# EAGLE schematic BMBurner V1.1 (EAGLE 8.6.0)
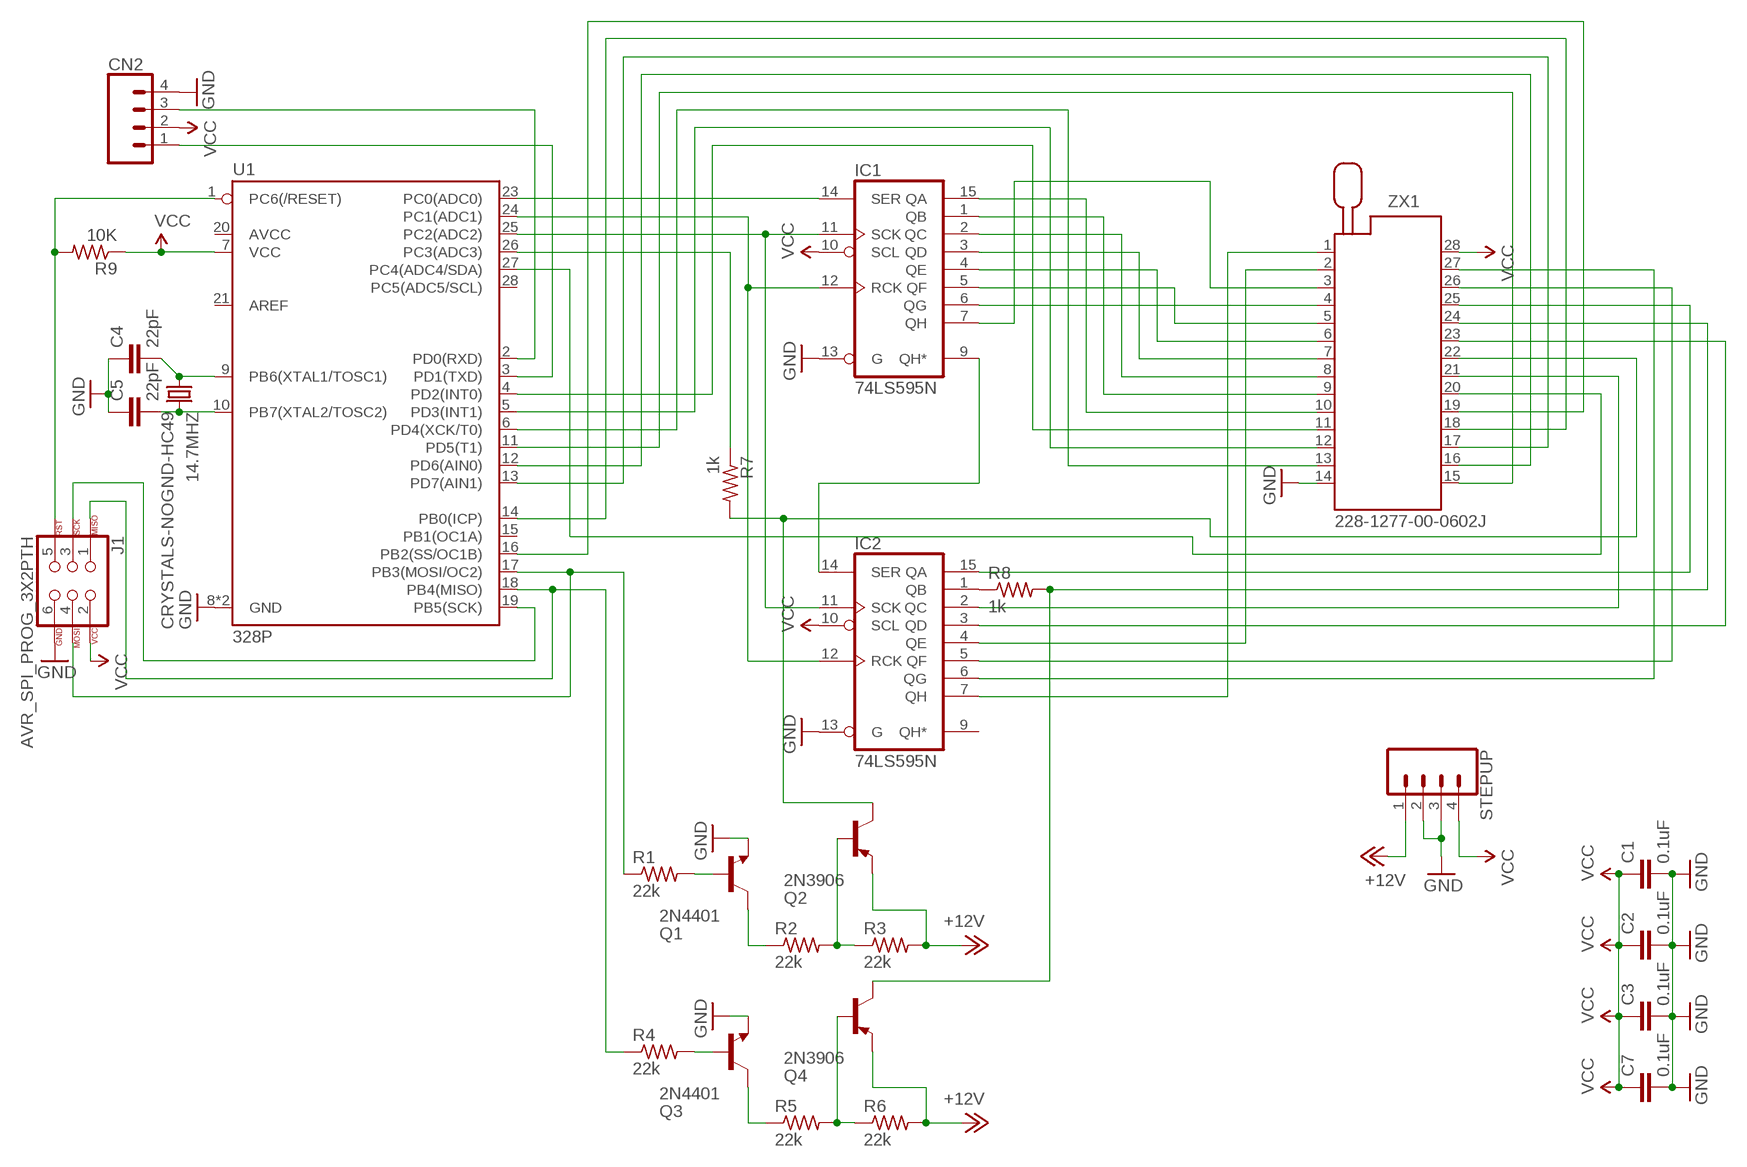
[diagram p0: schematic, sheet 1]

## Parts
14.7MHZ  CRYSTALS-NOGND-HC49  [HC49]
C1  0.1uF  CAPPTH  [CAP-PTH-SMALL]
C2  0.1uF  CAPPTH  [CAP-PTH-SMALL]
C3  0.1uF  CAPPTH  [CAP-PTH-SMALL]
C4  22pF  CAPPTH  [CAP-PTH-SMALL]
C5  22pF  CAPPTH  [CAP-PTH-SMALL]
C7  0.1uF  CAPPTH  [CAP-PTH-SMALL]
CN2  CONN_04  [1X04]
IC1  74LS595N  [DIL16]
IC2  74LS595N  [DIL16]
J1  AVR_SPI_PROG_3X2PTH  [2X3]
Q1  2N4401  BC447  [TO92-EBC]
Q2  2N3906  BC448  [TO92-EBC]
Q3  2N4401  BC447  [TO92-EBC]
Q4  2N3906  BC448  [TO92-EBC]
R1  22k  R-US_0204/5  [0204/5]
R2  22k  R-US_0204/5  [0204/5]
R3  22k  R-US_0204/5  [0204/5]
R4  22k  R-US_0204/5  [0204/5]
R5  22k  R-US_0204/5  [0204/5]
R6  22k  R-US_0204/5  [0204/5]
R7  1k  R-US_0204/5  [0204/5]
R8  1k  R-US_0204/5  [0204/5]
R9  10K  R-US_0204/5  [0204/5]
STEPUP  CONN_04  [1X04]
U1  328P  ATMEGA328P_PDIP  [DIP28]
ZX1  228-1277-00-0602J  [228-1277-00-0602J]

## Nets
+12V: Q2.E Q4.E R3.2 R6.2 STEPUP.1
GND: C1.2 C2.2 C3.2 C4.1 C5.1 C7.2 CN2.4 IC1.13(G) IC2.13(G) J1.6 Q1.E Q3.E STEPUP.2 STEPUP.3 U1.8(GND) U1.22(GND) ZX1.14
N$1: U1.27(PC4(ADC4/SDA)) ZX1.20
N$2: R7.1 U1.26(PC3(ADC3))
N$3: IC1.11(SCK) IC2.11(SCK) U1.25(PC2(ADC2))
N$4: IC2.4(QE) ZX1.2
N$6: Q2.C R7.2 ZX1.22
N$7: IC2.6(QG) ZX1.27
N$8: Q1.C R2.1
N$9: IC2.2(QC) ZX1.21
N$10: IC2.7(QH) ZX1.1
N$11: Q3.C R5.1
N$16: J1.5 R9.2 U1.1(PC6(/RESET))
N$17: 14.7MHZ.2 C5.2 U1.10(PB7(XTAL2/TOSC2))
N$19: CN2.1 U1.3(PD1(TXD))
N$20: 14.7MHZ.1 C4.2 U1.9(PB6(XTAL1/TOSC1))
N$21: J1.1 R4.1 U1.18(PB4(MISO))
N$22: CN2.3 U1.2(PD0(RXD))
N$23: U1.14(PB0(ICP)) ZX1.18
N$25: J1.4 R1.1 U1.17(PB3(MOSI/OC2))
N$28: J1.3 U1.19(PB5(SCK))
N$33: U1.5(PD3(INT1)) ZX1.12
N$34: U1.6(PD4(XCK/T0)) ZX1.13
N$35: U1.11(PD5(T1)) ZX1.15
N$36: U1.12(PD6(AIN0)) ZX1.16
N$38: U1.13(PD7(AIN1)) ZX1.17
N$39: Q1.B R1.2
N$41: U1.16(PB2(SS/OC1B)) ZX1.19
N$45: Q2.B R2.2 R3.1
N$46: Q3.B R4.2
N$48: Q4.B R5.2 R6.1
N$52: Q4.C R8.2 ZX1.24
N$53: IC2.1(QB) R8.1
N$54: IC2.15(QA) ZX1.25
N$57: IC1.12(RCK) IC2.12(RCK) U1.24(PC1(ADC1))
N$58: IC1.14(SER) U1.23(PC0(ADC0))
N$59: IC1.9(QH*) IC2.14(SER)
N$60: U1.4(PD2(INT0)) ZX1.11
N$68: IC1.15(QA) ZX1.10
N$69: IC1.1(QB) ZX1.9
N$70: IC1.2(QC) ZX1.8
N$71: IC1.3(QD) ZX1.7
N$72: IC1.4(QE) ZX1.6
N$73: IC1.5(QF) ZX1.5
N$74: IC1.6(QG) ZX1.4
N$75: IC1.7(QH) ZX1.3
N$76: IC2.3(QD) ZX1.23
N$80: IC2.5(QF) ZX1.26
VCC: C1.1 C2.1 C3.1 C7.1 CN2.2 IC1.10(SCL) IC2.10(SCL) J1.2 R9.1 STEPUP.4 U1.7(VCC) ZX1.28
Unconnected: IC2.9(QH*) U1.15(PB1(OC1A)) U1.20(AVCC) U1.21(AREF) U1.28(PC5(ADC5/SCL))

## Power pins joined to a net without a drawn wire
GND: IC1.8(GND) IC2.8(GND)
VCC: IC1.16(VCC) IC2.16(VCC)

## Library data of the parts
14.7MHZ = IQD-Frequency-Products:CRYSTALS-NOGND: CRYSTALS CAN NOT GROUNDED
C1-C5 C7 = SparkFun:CAP: Capacitor Standard 0603 ceramic capacitor, and 0.1" leaded capacitor.
CN2 STEPUP = SparkFun-Connectors:CONN_04: Multi connection point. Often used as Generic Header-pin footprint for 0.1 inch spaced/style header connections On any of the 0.1 inch spaced packages, you can populate with these: Break Away Headers - Straight <https://www.sparkfun.com/products/116> (PRT-00116) Break Away Male Headers - Right Angle <https://www.sparkfun.com/products/553> (PRT-00553) Female Headers <https://www.sparkfun.com/products/115> (PRT-00115) Break Away Headers - Machine Pin <https://www.sparkfun.com/products/117> (PRT-00117) Break Away Female Headers - Swiss Machine Pin <https://www.sparkfun.com/products/743> (PRT-00743) For SCREWTERMINALS and SPRING TERMINALS visit here: Screw Terimnals on SparkFun.com <https://www.sparkfun.com/search/results?term=Screw+Terminals> (5mm/3.5mm/2.54mm spacing) This device is also useful as a general connection point to wire up your design to another part of your project. Our various solder wires solder well into these plated through hole pads. Hook-Up Wire - Assortment (Stranded, 22 AWG) <https://www.sparkfun.com/products/11375> (PRT-11375) Hook-Up Wire - Assortment (Solid Core, 22 AWG) <https://www.sparkfun.com/products/11367> (PRT-11367) View the entire wire category on our website here <https://www.sparkfun.com/categories/141> Special notes: Molex polarized connector foot print use with SKU : PRT-08231 with associated crimp pins and housings. 1MM SMD Version SKU: PRT-10208; PROD_ID: CONN-09696
IC1 IC2 = 74xx-us_MOD:74*595: 8-bit SHIFT REGISTER, output latch; SPICEPREFIX: X
J1 = SparkFun-Connectors_MOD:AVR_SPI_PROG_3X2: AVR ISP 6 Pin This is the reduced ISP connector for AVR programming. Common on Arduino. This footprint will take up less PCB space and can be used with a 10-pin to 6-pin adapter such as SKU: BOB-08508 **Special note about "TEST_POINT" package. The stop mask is on the top side, so if you want your programming test points to be on the bottom of your board, make sure to place this package on the bottom side of the board. This also ensure that the orientation to program from the bottom side will be correct. SparkFun Products: SparkFun ISP Pogo Adapter <https://www.sparkfun.com/products/11591> - NS Tiny AVR Programmer <https://www.sparkfun.com/products/11801> -PTH
Q1 Q3 = transistor-npn_MOD:BC447*: NPN Transistor
Q2 Q4 = transistor-pnp_MOD:BC448*: PNP Transistror
R1 = resistor:R-US_: RESISTOR, American symbol; SPICEPREFIX: R
R2-R9 = resistor:R-US_: RESISTOR, American symbol
U1 = SparkFun-IC-Microcontroller:ATMEGA328P_PDIP: Atmel 328P Through hole ATMEGA328P uC used in the Arduino 32kb flash, 1k EEPROM, 2k SRAM Datasheet <http://www.sparkfun.com/datasheets/Components/SMD/ATMega328.pdf> SparkFun Products Storefront component: AVR 28 Pin 20MHz 32K 6A/D - ATMega328P <https://www.sparkfun.com/products/9061> (COM-09061) SparkFun Simon Says - Through-Hole Soldering Kit <https://www.sparkfun.com/products/10547> (KIT-10547) SparkFun Learn to Solder - Simon Says <https://www.sparkfun.com/products/13708> (KIT-13708) SparkFun BigTime Watch Kit <https://www.sparkfun.com/products/11734> (KIT-11734) SparkFun ClockIt <https://www.sparkfun.com/products/10930> (KIT-10930) SparkFun Serial Enabled LCD Kit <https://www.sparkfun.com/products/10097> (LCD-10097) SparkFun Simon Tilts - Through Hole Soldering Kit <https://www.sparkfun.com/products/12634> (KIT-12634) SparkFun Frequency Counter Kit <https://www.sparkfun.com/products/10140> (KIT-10140) FabFM Radio Kit <https://www.sparkfun.com/products/11043> (KIT-11043) SparkFun Binary Blaster Kit <https://www.sparkfun.com/products/12037> (KIT-12037) SparkFun Metro-Gnome <https://www.sparkfun.com/products/9236> (KIT-09236) ATmega328 with Arduino Optiboot (Uno) <https://www.sparkfun.com/products/10524> (DEV-10524); PROD_ID: IC-09136
ZX1 = con-3m_MOD:228-?00-0602J: Zero Insertion Force Socked Source: http://www.3M.com/ehpd; MF: 3M; MPN: 228-1277-00-0602J; OC_FARNELL: 9897356; OC_NEWARK: 85K7825

## Net classes
0 default: clearance 0.205 mm